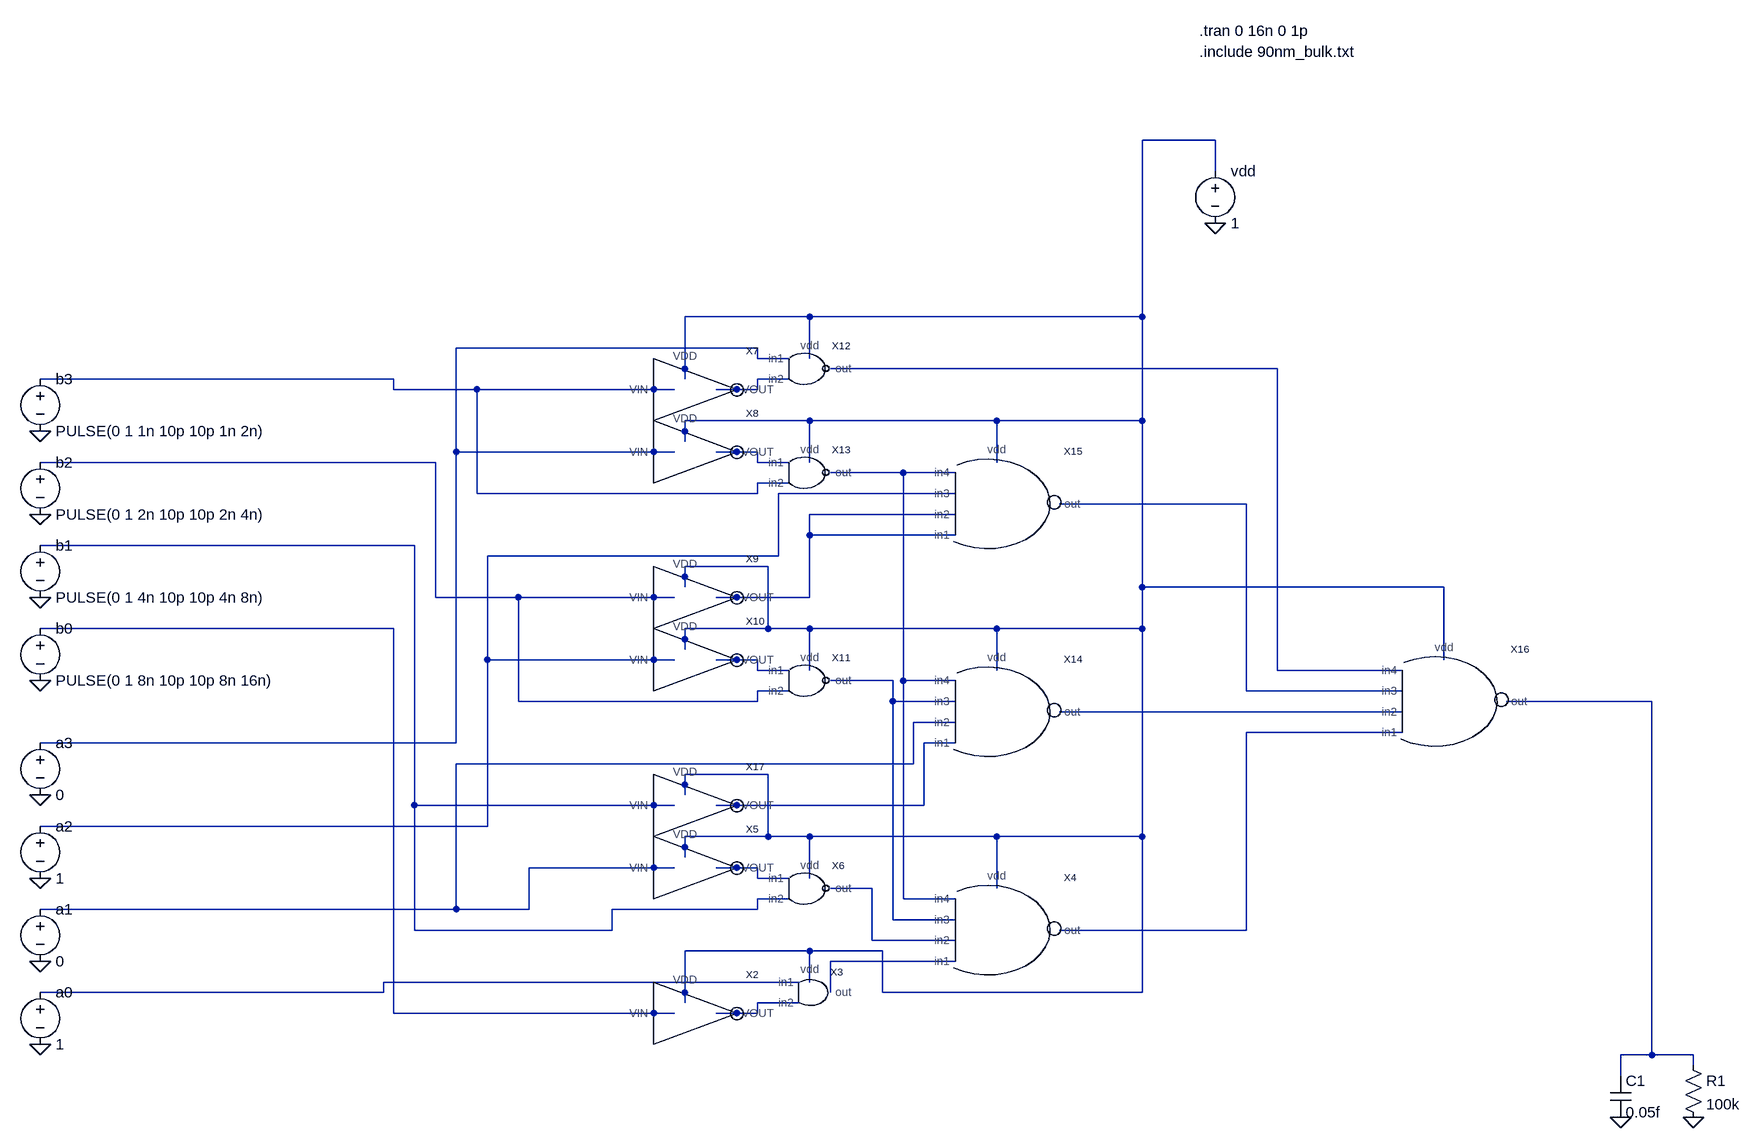
[diagram p0: schematic Comparator-test.asc]
Comparator-test.asc, the LTspice schematic file:
Version 4
SHEET 1 2116 964
WIRE 1296 -560 1184 -560
WIRE 1296 -512 1296 -560
WIRE 672 -288 480 -288
WIRE 1184 -288 1184 -560
WIRE 1184 -288 672 -288
WIRE 592 -240 128 -240
WIRE 592 -224 592 -240
WIRE 640 -224 592 -224
WIRE 672 -224 672 -288
WIRE 1392 -208 704 -208
WIRE 32 -192 -512 -192
WIRE 480 -192 480 -288
WIRE 640 -192 592 -192
WIRE 32 -176 32 -192
WIRE 160 -176 32 -176
WIRE 464 -176 160 -176
WIRE 592 -176 592 -192
WIRE 592 -176 528 -176
WIRE 672 -128 480 -128
WIRE 960 -128 672 -128
WIRE 1184 -128 1184 -288
WIRE 1184 -128 960 -128
WIRE 480 -96 480 -128
WIRE 128 -80 128 -240
WIRE 464 -80 128 -80
WIRE 592 -80 528 -80
WIRE 96 -64 -512 -64
WIRE 592 -64 592 -80
WIRE 640 -64 592 -64
WIRE 672 -64 672 -128
WIRE 960 -64 960 -128
WIRE 816 -48 704 -48
WIRE 896 -48 816 -48
WIRE 640 -32 592 -32
WIRE 160 -16 160 -176
WIRE 592 -16 592 -32
WIRE 592 -16 160 -16
WIRE 896 -16 624 -16
WIRE 1344 0 1056 0
WIRE 896 16 672 16
WIRE 672 48 672 16
WIRE 896 48 672 48
WIRE 64 64 -512 64
WIRE 624 80 624 -16
WIRE 624 80 176 80
WIRE 608 96 480 96
WIRE 480 128 480 96
WIRE 1184 128 1184 -128
WIRE 1648 128 1184 128
WIRE 96 144 96 -64
WIRE 224 144 96 144
WIRE 464 144 224 144
WIRE 672 144 672 48
WIRE 672 144 528 144
WIRE 32 192 -512 192
WIRE 608 192 608 96
WIRE 608 192 480 192
WIRE 672 192 608 192
WIRE 960 192 672 192
WIRE 1184 192 1184 128
WIRE 1184 192 960 192
WIRE 480 224 480 192
WIRE 176 240 176 80
WIRE 464 240 176 240
WIRE 592 240 528 240
WIRE 1648 240 1648 128
WIRE 592 256 592 240
WIRE 640 256 592 256
WIRE 672 256 672 192
WIRE 960 256 960 192
WIRE 1392 256 1392 -208
WIRE 1584 256 1392 256
WIRE 800 272 704 272
WIRE 816 272 816 -48
WIRE 896 272 816 272
WIRE 640 288 592 288
WIRE 1344 288 1344 0
WIRE 1584 288 1344 288
WIRE 224 304 224 144
WIRE 592 304 592 288
WIRE 592 304 224 304
WIRE 800 304 800 272
WIRE 896 304 800 304
WIRE 1968 304 1744 304
WIRE 1584 320 1056 320
WIRE 896 336 832 336
WIRE 1584 352 1344 352
WIRE 128 368 128 -80
WIRE 128 368 -512 368
WIRE 896 368 848 368
WIRE 832 400 832 336
WIRE 832 400 128 400
WIRE 608 416 480 416
WIRE 480 448 480 416
WIRE 64 464 64 64
WIRE 464 464 64 464
WIRE 848 464 848 368
WIRE 848 464 528 464
WIRE 176 496 176 240
WIRE 176 496 -512 496
WIRE 608 512 608 416
WIRE 608 512 480 512
WIRE 672 512 608 512
WIRE 960 512 672 512
WIRE 1184 512 1184 192
WIRE 1184 512 960 512
WIRE 480 544 480 512
WIRE 464 560 240 560
WIRE 592 560 528 560
WIRE 592 576 592 560
WIRE 640 576 592 576
WIRE 672 576 672 512
WIRE 768 592 704 592
WIRE 960 592 960 512
WIRE 640 608 592 608
WIRE 816 608 816 272
WIRE 896 608 816 608
WIRE 128 624 128 400
WIRE 128 624 -512 624
WIRE 240 624 240 560
WIRE 240 624 128 624
WIRE 592 624 592 608
WIRE 592 624 368 624
WIRE 800 640 800 304
WIRE 896 640 800 640
WIRE 64 656 64 464
WIRE 368 656 368 624
WIRE 368 656 64 656
WIRE 1344 656 1344 352
WIRE 1344 656 1056 656
WIRE 768 672 768 592
WIRE 896 672 768 672
WIRE 672 688 480 688
WIRE 784 688 672 688
WIRE 896 704 704 704
WIRE 656 736 16 736
WIRE 672 736 672 688
WIRE 16 752 16 736
WIRE 16 752 -512 752
WIRE 704 752 704 704
WIRE 784 752 784 688
WIRE 1184 752 1184 512
WIRE 1184 752 784 752
WIRE 480 768 480 688
WIRE 656 768 592 768
WIRE 32 784 32 192
WIRE 464 784 32 784
WIRE 592 784 592 768
WIRE 592 784 528 784
WIRE 1968 848 1968 304
WIRE 1968 848 1920 848
WIRE 2032 848 1968 848
WIRE 2032 864 2032 848
WIRE 1920 880 1920 848
FLAG -512 144 0
FLAG -512 272 0
FLAG -512 16 0
FLAG -512 -112 0
FLAG 1920 944 0
FLAG 2032 944 0
FLAG -512 704 0
FLAG -512 832 0
FLAG -512 576 0
FLAG -512 448 0
FLAG 1296 -432 0
SYMBOL voltage -512 176 R0
WINDOW 123 0 0 Left 2
WINDOW 39 0 0 Left 2
SYMATTR InstName b0
SYMATTR Value PULSE(0 1 8n 10p 10p 8n 16n)
SYMBOL voltage -512 48 R0
WINDOW 123 0 0 Left 2
WINDOW 39 0 0 Left 2
SYMATTR InstName b1
SYMATTR Value PULSE(0 1 4n 10p 10p 4n 8n)
SYMBOL voltage -512 -80 R0
WINDOW 123 0 0 Left 2
WINDOW 39 0 0 Left 2
SYMATTR InstName b2
SYMATTR Value PULSE(0 1 2n 10p 10p 2n 4n)
SYMBOL voltage -512 -208 R0
WINDOW 123 0 0 Left 2
WINDOW 39 0 0 Left 2
SYMATTR InstName b3
SYMATTR Value PULSE(0 1 1n 10p 10p 1n 2n)
SYMBOL res 2016 848 R0
SYMATTR InstName R1
SYMATTR Value 100k
SYMBOL cap 1904 880 R0
SYMATTR InstName C1
SYMATTR Value 0.05f
SYMBOL voltage -512 736 R0
WINDOW 123 0 0 Left 2
WINDOW 39 0 0 Left 2
SYMATTR InstName a0
SYMATTR Value 1
SYMBOL voltage -512 608 R0
WINDOW 123 0 0 Left 2
WINDOW 39 0 0 Left 2
SYMATTR InstName a1
SYMATTR Value 0
SYMBOL voltage -512 480 R0
WINDOW 123 0 0 Left 2
WINDOW 39 0 0 Left 2
SYMATTR InstName a2
SYMATTR Value 1
SYMBOL voltage -512 352 R0
WINDOW 123 0 0 Left 2
WINDOW 39 0 0 Left 2
SYMATTR InstName a3
SYMATTR Value 0
SYMBOL voltage 1296 -528 R0
WINDOW 123 0 0 Left 2
WINDOW 39 0 0 Left 2
SYMATTR InstName vdd
SYMATTR Value 1
SYMBOL inverter 480 784 R0
SYMATTR InstName X2
SYMBOL and 672 752 R0
SYMATTR InstName X3
SYMBOL nand4 928 672 R0
SYMATTR InstName X4
SYMBOL inverter 480 560 R0
SYMATTR InstName X5
SYMBOL nand 656 592 R0
SYMATTR InstName X6
SYMBOL inverter 480 -176 R0
SYMATTR InstName X7
SYMBOL inverter 480 -80 R0
SYMATTR InstName X8
SYMBOL inverter 480 144 R0
SYMATTR InstName X9
SYMBOL inverter 480 240 R0
SYMATTR InstName X10
SYMBOL nand 656 272 R0
SYMATTR InstName X11
SYMBOL nand 656 -208 R0
SYMATTR InstName X12
SYMBOL nand 656 -48 R0
SYMATTR InstName X13
SYMBOL nand4 928 336 R0
SYMATTR InstName X14
SYMBOL nand4 928 16 R0
SYMATTR InstName X15
SYMBOL nand4 1616 320 R0
SYMATTR InstName X16
SYMBOL inverter 480 464 R0
SYMATTR InstName X17
TEXT 1272 -696 Left 2 !.include 90nm_bulk.txt
TEXT 1272 -728 Left 2 !.tran 0 16n 0 1p

The netlist it stands for:
* Comparator-test.asc
V§b0 N013 0 PULSE(0 1 8n 10p 10p 8n 16n)
V§b1 N012 0 PULSE(0 1 4n 10p 10p 4n 8n)
V§b2 N007 0 PULSE(0 1 2n 10p 10p 2n 4n)
V§b3 N004 0 PULSE(0 1 1n 10p 10p 1n 2n)
R1 N016 0 100k
C1 N016 0 0.05f
V§a0 N024 0 1
V§a1 N018 0 0
V§a2 N009 0 1
V§a3 N002 0 0
vdd N001 0 1
XX2 N001 N025 N013 inverter  ; pins VDD VOUT VIN
XX3 N024 N025 N001 N023 and  ; pins in1 in2 vdd out
XX4 N023 N022 N015 N008 N019 N001 nand4  ; pins in1 in2 in3 in4 out vdd
XX5 N001 N021 N018 inverter  ; pins VDD VOUT VIN
XX6 N021 N012 N022 N001 nand  ; pins in1 in2 out vdd
XX7 N001 N005 N004 inverter  ; pins VDD VOUT VIN
XX8 N001 N006 N002 inverter  ; pins VDD VOUT VIN
XX9 N001 N011 N007 inverter  ; pins VDD VOUT VIN
XX10 N001 N014 N009 inverter  ; pins VDD VOUT VIN
XX11 N014 N007 N015 N001 nand  ; pins in1 in2 out vdd
XX12 N002 N005 N003 N001 nand  ; pins in1 in2 out vdd
XX13 N006 N004 N008 N001 nand  ; pins in1 in2 out vdd
XX14 N020 N018 N015 N008 N017 N001 nand4  ; pins in1 in2 in3 in4 out vdd
XX15 N011 N011 N009 N008 N010 N001 nand4  ; pins in1 in2 in3 in4 out vdd
XX16 N019 N017 N010 N003 N016 N001 nand4  ; pins in1 in2 in3 in4 out vdd
XX17 N001 N020 N012 inverter  ; pins VDD VOUT VIN
.include 90nm_bulk.txt
.tran 0 16n 0 1p
.backanno
.end